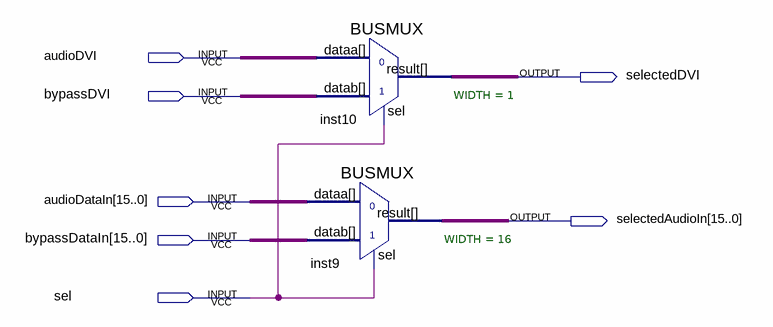
[diagram p0: schematic sheet]
// Quartus schematic audioBypassMux.bdf as structural Verilog: 2 symbols, 7 pins
module audioBypassMux (
  input  audioDVI,
  input  bypassDVI,
  input  [15:0] audioDataIn,
  input  [15:0] bypassDataIn,
  input  sel,
  output selectedDVI,
  output [15:0] selectedAudioIn
);

  BUSMUX #(.WIDTH(1)) inst10 (.datab(bypassDVI), .sel(sel), .dataa(audioDVI), .result(selectedDVI));
  BUSMUX #(.WIDTH(16)) inst9 (.datab(bypassDataIn), .sel(sel), .dataa(audioDataIn), .result(selectedAudioIn));
endmodule
